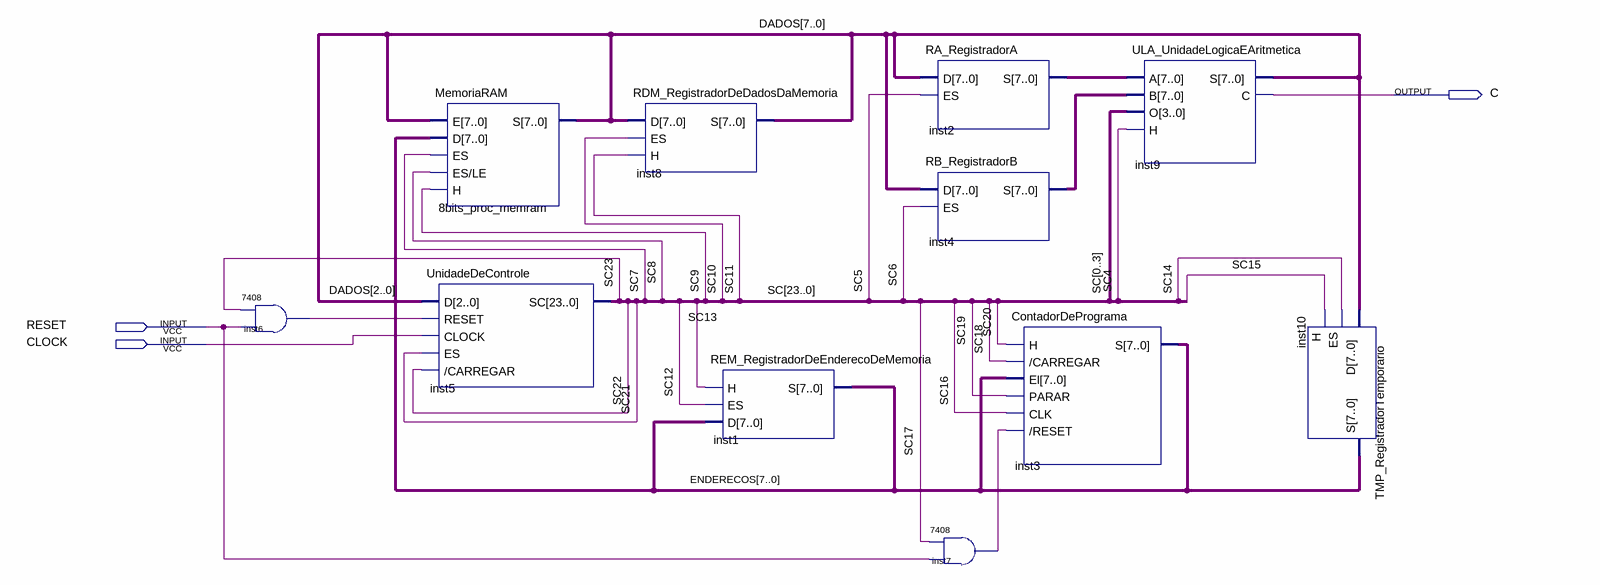
[diagram p0: schematic sheet]
// Quartus schematic Processador8Bits.bdf as structural Verilog: 11 symbols, 3 pins
module Processador8Bits (
  input  RESET,
  input  CLOCK,
  output C
);

  wire inst6_1, inst7_1;
  wire [7:0] DADOS, ENDERECOS, inst2_s, inst4_s;
  wire [23:0] SC;

  \7408  inst6 (.\3 (RESET), .\2 (SC[23]), .\1 (inst6_1));
  MemoriaRAM u_8bits_proc_memram (.E(DADOS), .D(ENDERECOS), .ES(SC[7]), .\ES/LE (SC[8]), .H(SC[9]), .S(DADOS));
  UnidadeDeControle inst5 (.D(DADOS[2:0]), .RESET(inst6_1), .CLOCK(CLOCK), .ES(SC[21]), .\/CARREGAR (SC[22]), .SC(SC));
  RDM_RegistradorDeDadosDaMemoria inst8 (.D(DADOS), .ES(SC[10]), .H(SC[11]), .S(DADOS));
  REM_RegistradorDeEnderecoDeMemoria inst1 (.H(SC[13]), .ES(SC[12]), .D(ENDERECOS), .S(ENDERECOS));
  RA_RegistradorA inst2 (.D(DADOS), .ES(SC[5]), .S(inst2_s));
  RB_RegistradorB inst4 (.D(DADOS), .ES(SC[6]), .S(inst4_s));
  \7408  inst7 (.\3 (RESET), .\2 (SC[17]), .\1 (inst7_1));
  ContadorDePrograma inst3 (
    .H(SC[20]), .\/CARREGAR (SC[18]), .El(ENDERECOS), .PARAR(SC[19]), .CLK(SC[16]), .\/RESET (inst7_1),
    .S(ENDERECOS));
  ULA_UnidadeLogicaEAritmetica inst9 (
    .A(inst2_s), .B(inst4_s), .O({SC[0], SC[1], SC[2], SC[3]}), .H(SC[4]), .S(DADOS), .C(C));
  TMP_RegistradorTemporario inst10 (.D(DADOS), .ES(SC[14]), .H(SC[15]), .S(ENDERECOS));
endmodule
